# EAGLE schematic v2 (EAGLE 9.6.2)
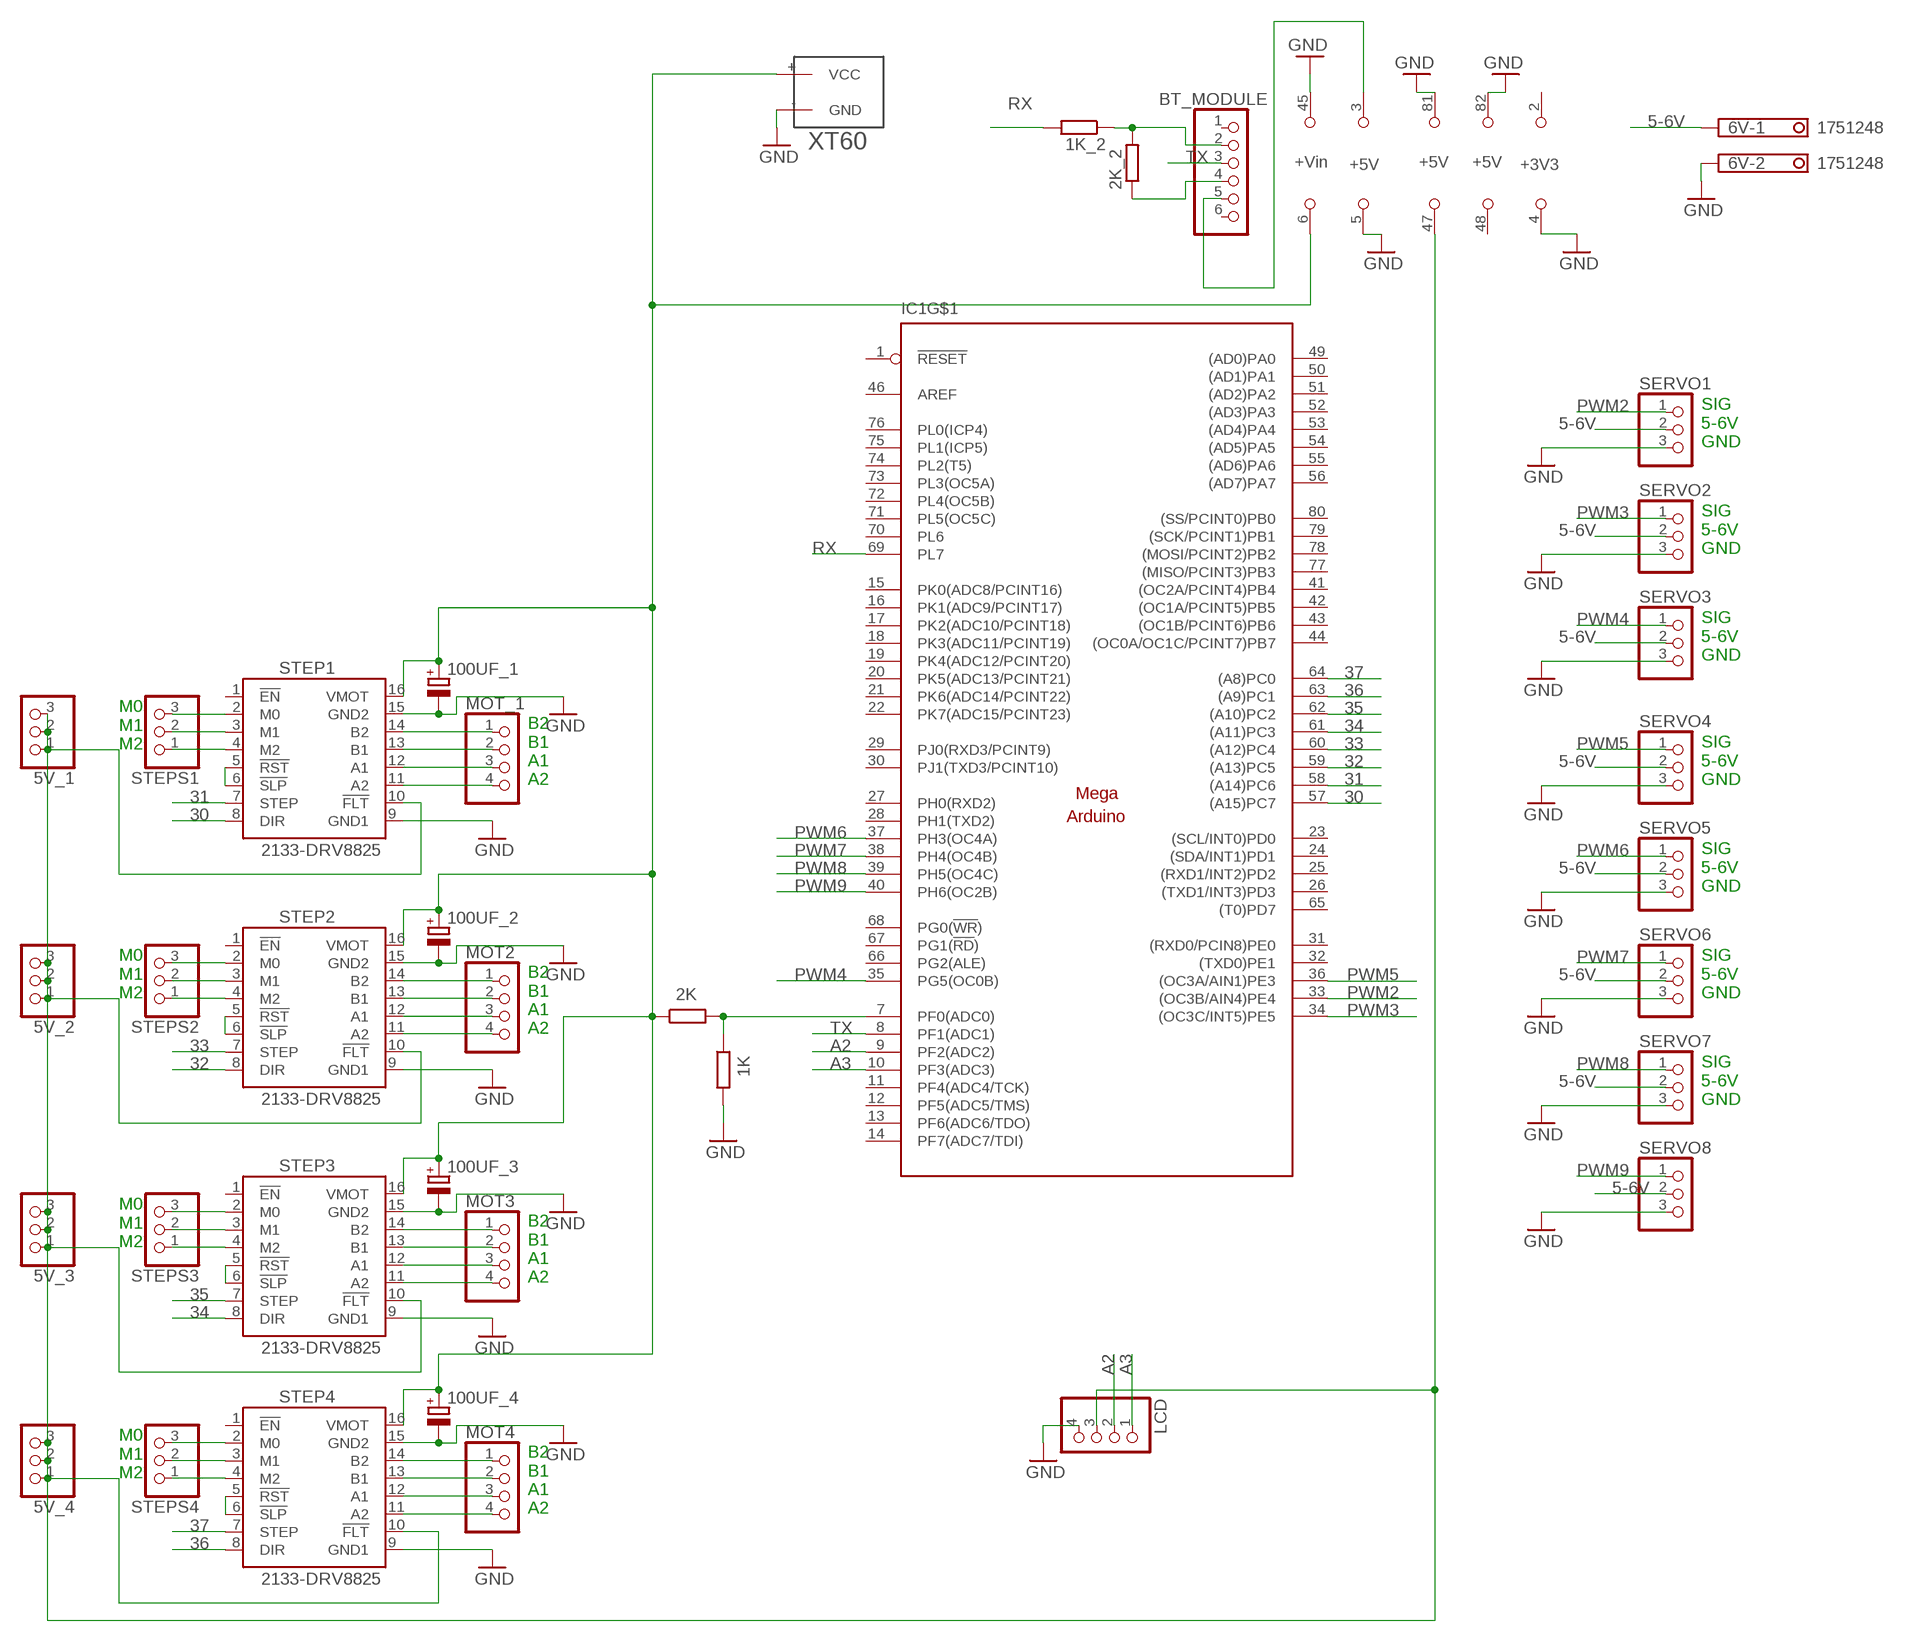
[diagram p0: schematic, sheet 1]

## Parts
1K  R-EU_0204/7  [0204/7]
1K_2  R-EU_0204/7  [0204/7]
2K  R-EU_0204/7  [0204/7]
2K_2  R-EU_0204/7  [0204/7]
5V_1  PINHD-1X3  [1X03]
5V_2  PINHD-1X3  [1X03]
5V_3  PINHD-1X3  [1X03]
5V_4  PINHD-1X3  [1X03]
6V  1751248  [1751248]
100UF_1  CPOL-EUE5-5  [E5-5]
100UF_2  CPOL-EUE5-5  [E5-5]
100UF_3  CPOL-EUE5-5  [E5-5]
100UF_4  CPOL-EUE5-5  [E5-5]
BT_MODULE  PINHD-1X6  [1X06]
IC1  MEGAARDUINO_22  [MEGA_ARDUINO_2]
LCD  PINHD-1X4  [1X04]
MOT2  PINHD-1X4  [1X04]
MOT3  PINHD-1X4  [1X04]
MOT4  PINHD-1X4  [1X04]
MOT_1  PINHD-1X4  [1X04]
SERVO1  PINHD-1X3  [1X03]
SERVO2  PINHD-1X3  [1X03]
SERVO3  PINHD-1X3  [1X03]
SERVO4  PINHD-1X3  [1X03]
SERVO5  PINHD-1X3  [1X03]
SERVO6  PINHD-1X3  [1X03]
SERVO7  PINHD-1X3  [1X03]
SERVO8  PINHD-1X3  [1X03]
STEP1  2133-DRV8825  [DRV8825]
STEP2  2133-DRV8825  [DRV8825]
STEP3  2133-DRV8825  [DRV8825]
STEP4  2133-DRV8825  [DRV8825]
STEPS1  PINHD-1X3  [1X03]
STEPS2  PINHD-1X3  [1X03]
STEPS3  PINHD-1X3  [1X03]
STEPS4  PINHD-1X3  [1X03]
U$1  XT60  [XT60]

## Nets
5-6V [ALL]: 6V.1 SERVO1.2 SERVO2.2 SERVO3.2 SERVO4.2 SERVO5.2 SERVO6.2 SERVO7.2 SERVO8.2
12V1 [12V]: 2K.1 100UF_1.+ 100UF_2.+ 100UF_3.+ 100UF_4.+ IC1.6(+VIN) STEP1.16(VMOT) STEP2.16(VMOT) STEP3.16(VMOT) STEP4.16(VMOT) U$1.+(VCC)
30 [ALL]: IC1.57((A15)PC7) STEP1.8(DIR)
31 [ALL]: IC1.58((A14)PC6) STEP1.7(STEP)
32 [ALL]: IC1.59((A13)PC5) STEP2.8(DIR)
33 [ALL]: IC1.60((A12)PC4) STEP2.7(STEP)
34 [ALL]: IC1.61((A11)PC3) STEP3.8(DIR)
35 [ALL]: IC1.62((A10)PC2) STEP3.7(STEP)
36 [ALL]: IC1.63((A9)PC1) STEP4.8(DIR)
37: IC1.64((A8)PC0) STEP4.7(STEP)
A2 [ALL]: IC1.9(PF2(ADC2)) LCD.2
A3 [ALL]: IC1.10(PF3(ADC3)) LCD.1
GND [ALL]: 1K.2 6V.2 100UF_1.- 100UF_2.- 100UF_3.- 100UF_4.- IC1.4(GND) IC1.5(GND) IC1.45(GND) IC1.81(GND) IC1.82(GND) LCD.4 SERVO1.3 SERVO2.3 SERVO3.3 SERVO4.3 SERVO5.3 SERVO6.3 SERVO7.3 SERVO8.3 STEP1.9(GND1) STEP1.15(GND2) STEP2.9(GND1) STEP2.15(GND2) STEP3.9(GND1) STEP3.15(GND2) STEP4.9(GND1) STEP4.15(GND2) U$1.-(GND)
N$1 [ALL]: 1K.1 2K.2 IC1.7(PF0(ADC0))
N$2 [ALL]: MOT_1.1 STEP1.14(B2)
N$3 [ALL]: MOT_1.2 STEP1.13(B1)
N$4 [ALL]: MOT_1.3 STEP1.12(A1)
N$5 [ALL]: MOT_1.4 STEP1.11(A2)
N$6 [ALL]: MOT2.1 STEP2.14(B2)
N$7 [ALL]: MOT2.2 STEP2.13(B1)
N$8 [ALL]: MOT2.3 STEP2.12(A1)
N$9 [ALL]: MOT2.4 STEP2.11(A2)
N$10 [ALL]: MOT3.1 STEP3.14(B2)
N$11 [ALL]: MOT3.2 STEP3.13(B1)
N$12 [12V]: MOT3.3 STEP3.12(A1)
N$13 [ALL]: MOT3.4 STEP3.11(A2)
N$14 [ALL]: MOT4.1 STEP4.14(B2)
N$15 [ALL]: MOT4.2 STEP4.13(B1)
N$16 [ALL]: MOT4.3 STEP4.12(A1)
N$17 [ALL]: MOT4.4 STEP4.11(A2)
N$18 [ALL]: STEP1.2(M0) STEPS1.3
N$19 [ALL]: 2K_2.1 BT_MODULE.4
N$20 [ALL]: 1K_2.1 2K_2.2 BT_MODULE.2
N$21 [ALL]: BT_MODULE.5 IC1.3(+5V)
N$22 [ALL]: STEP1.3(M1) STEPS1.2
N$23 [ALL]: STEP1.4(M2) STEPS1.1
N$24 [ALL]: STEP2.2(M0) STEPS2.3
N$25 [ALL]: STEP2.3(M1) STEPS2.2
N$26 [ALL]: STEP2.4(M2) STEPS2.1
N$27 [ALL]: STEP3.2(M0) STEPS3.3
N$28 [ALL]: STEP3.3(M1) STEPS3.2
N$29 [ALL]: STEP3.4(M2) STEPS3.1
N$30 [ALL]: STEP4.2(M0) STEPS4.3
N$31 [ALL]: STEP4.3(M1) STEPS4.2
N$32 [ALL]: STEP4.4(M2) STEPS4.1
N$33 [ALL]: STEP1.5(!RST) STEP1.6(!SLP)
N$34 [ALL]: STEP2.5(!RST) STEP2.6(!SLP)
N$35 [ALL]: STEP3.5(!RST) STEP3.6(!SLP)
N$36 [ALL]: STEP4.5(!RST) STEP4.6(!SLP)
N$37 [ALL]: 5V_1.1 5V_1.2 5V_1.3 5V_2.1 5V_2.2 5V_2.3 5V_3.1 5V_3.2 5V_3.3 5V_4.1 5V_4.2 5V_4.3 IC1.47(+5V) LCD.3 STEP1.10(!FLT) STEP2.10(!FLT) STEP3.10(!FLT) STEP4.10(!FLT)
PWM2 [ALL]: IC1.33((OC3B/AIN4)PE4) SERVO1.1
PWM3 [ALL]: IC1.34((OC3C/INT5)PE5) SERVO2.1
PWM4 [ALL]: IC1.35(PG5(OC0B)) SERVO3.1
PWM5 [ALL]: IC1.36((OC3A/AIN1)PE3) SERVO4.1
PWM6 [ALL]: IC1.37(PH3(OC4A)) SERVO5.1
PWM7 [ALL]: IC1.38(PH4(OC4B)) SERVO6.1
PWM8 [ALL]: IC1.39(PH5(OC4C)) SERVO7.1
PWM9 [ALL]: IC1.40(PH6(OC2B)) SERVO8.1
RX [ALL]: 1K_2.2 IC1.69(PL7)
TX [ALL]: BT_MODULE.3 IC1.8(PF1(ADC1))
Unconnected: BT_MODULE.1 BT_MODULE.6 IC1.1(!RESET) IC1.11(PF4(ADC4/TCK)) IC1.12(PF5(ADC5/TMS)) IC1.13(PF6(ADC6/TDO)) IC1.14(PF7(ADC7/TDI)) IC1.15(PK0(ADC8/PCINT16)) IC1.16(PK1(ADC9/PCINT17)) IC1.17(PK2(ADC10/PCINT18)) IC1.18(PK3(ADC11/PCINT19)) IC1.19(PK4(ADC12/PCINT20)) IC1.20(PK5(ADC13/PCINT21)) IC1.21(PK6(ADC14/PCINT22)) IC1.22(PK7(ADC15/PCINT23)) IC1.23((SCL/INT0)PD0) IC1.24((SDA/INT1)PD1) IC1.25((RXD1/INT2)PD2) IC1.26((TXD1/INT3)PD3) IC1.27(PH0(RXD2)) IC1.28(PH1(TXD2)) IC1.29(PJ0(RXD3/PCINT9)) IC1.30(PJ1(TXD3/PCINT10)) IC1.31((RXD0/PCIN8)PE0) IC1.32((TXD0)PE1) IC1.41((OC2A/PCINT4)PB4) IC1.42((OC1A/PCINT5)PB5) IC1.43((OC1B/PCINT6)PB6) IC1.44((OC0A/OC1C/PCINT7)PB7) IC1.46(AREF) IC1.49((AD0)PA0) IC1.50((AD1)PA1) IC1.51((AD2)PA2) IC1.52((AD3)PA3) IC1.53((AD4)PA4) IC1.54((AD5)PA5) IC1.55((AD6)PA6) IC1.56((AD7)PA7) IC1.65((T0)PD7) IC1.66(PG2(ALE)) IC1.67(PG1(!RD!)) IC1.68(PG0(!WR!)) IC1.70(PL6) IC1.71(PL5(OC5C)) IC1.72(PL4(OC5B)) IC1.73(PL3(OC5A)) IC1.74(PL2(T5)) IC1.75(PL1(ICP5)) IC1.76(PL0(ICP4)) IC1.77((MISO/PCINT3)PB3) IC1.78((MOSI/PCINT2)PB2) IC1.79((SCK/PCINT1)PB1) IC1.80((SS/PCINT0)PB0) STEP1.1(!EN) STEP2.1(!EN) STEP3.1(!EN) STEP4.1(!EN)

## Notes on the sheet
- SIG
  5-6V
  GND
- SIG
  5-6V
  GND
- SIG
  5-6V
  GND
- M0
  M1
  M2
- B2
  B1
  A1
  A2
- SIG
  5-6V
  GND
- SIG
  5-6V
  GND
- M0
  M1
  M2
- SIG
  5-6V
  GND
- B2
  B1
  A1
  A2
- SIG
  5-6V
  GND
- M0
  M1
  M2
- B2
  B1
  A1
  A2
- M0
  M1
  M2
- B2
  B1
  A1
  A2

## Power pins joined to a net without a drawn wire
+3V3: IC1.2(+3V3)
+5V: IC1.48(+5V)

## Library data of the parts
1K 1K_2 2K 2K_2 = rcl:R-EU_: RESISTOR, European symbol; SPICEPREFIX: R
5V_1-5V_4 SERVO1-SERVO8 STEPS1-STEPS4 = pinhead:PINHD-1X3: PIN HEADER
6V = con-phoenix-350:1751248: MKDS 1/ 2-3,5 Printklemme Nennstrom: 10 A Bemessungsspannung: 160 V Raster: 3,5 mm Polzahl: 2 Montageart: Löten Anschlussart: Schraubanschluss Anschlussrichtung vom Leiter zur Platine: 0° Source: http://eshop.phoenixcontact.com .. 1751248.pdf; OC_FARNELL: unknown; OC_NEWARK: unknown
100UF_1-100UF_4 = rcl:CPOL-EU: POLARIZED CAPACITOR, European symbol; SPICEPREFIX: C
BT_MODULE = pinhead:PINHD-1X6: PIN HEADER
IC1 = arduino:MEGAARDUINO_2: The Arduino Mega is a microcontroller board based on the ATmega1280. - 54 digital input/output pins (of which 14 can be used as PWM outputs) - 16 analog inputs - 4 UARTs (hardware serial ports) - 16 MHz crystal oscillator - USB connection - power jack - ICSP header - reset button It contains everything needed to support the microcontroller; simply connect it to a computer with a USB cable or power it with a AC-to-DC adapter or battery to get started. The Mega is compatible with most shields designed for the Arduino Duemilanove or Diecimila. http://arduino.cc/en/Main/ArduinoBoardMega
LCD MOT2-MOT4 MOT_1 = pinhead:PINHD-1X4: PIN HEADER
STEP1-STEP4 = pololu-stepper-driver:2133-DRV8825: DRV8825 Stepper Motor Driver Carrier, High Current #2133 DRV8825 Stepper Motor Driver Carrier; High Current <https://www.pololu.com/product/2133> in Japan, Suzaku Lab. Ltd. <https://suzakugiken.jp/> #2133 DRV8825 大電流用ステッピングモータドライバ <https://szc.jp/po2133>
U$1 = XT60:XT60: XT60

## Net classes
1 12V: width 1.016 mm, clearance 0.076 mm
2 ALL: width 0.381 mm, clearance 0.076 mm